# EAGLE design schematic (EAGLE 7.3.0)

## Sheet 1 of 4: Pixhawk Servo Interface
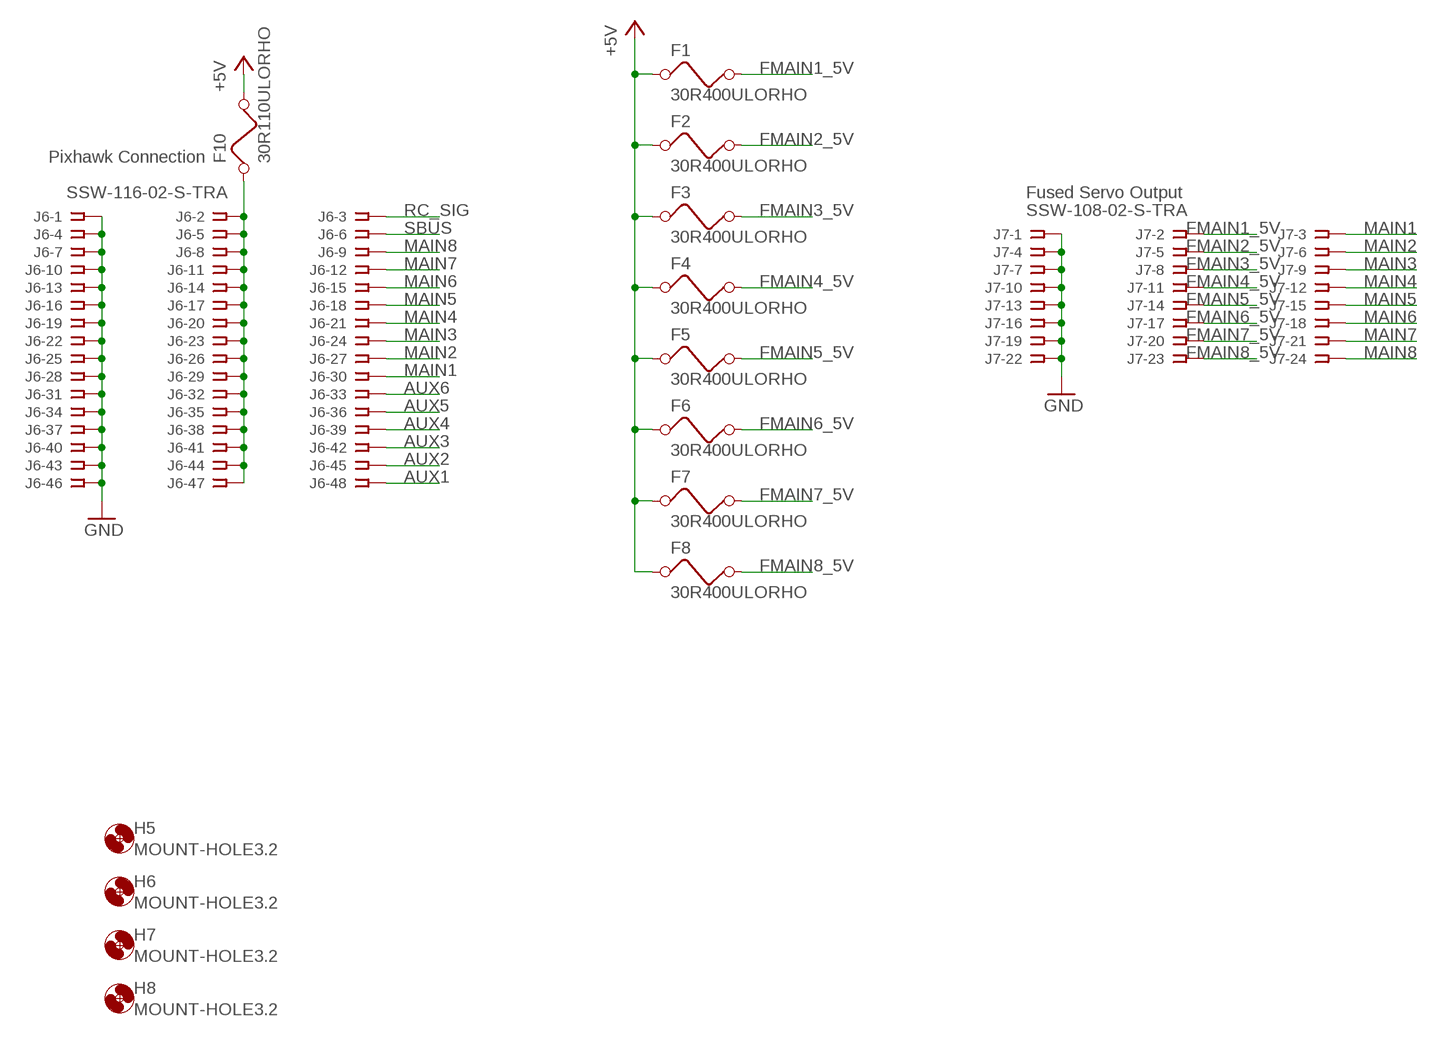
[diagram p0: schematic, sheet 1]

### Parts
F1  30R400ULORHO  [1206]
F2  30R400ULORHO  [1206]
F3  30R400ULORHO  [1206]
F4  30R400ULORHO  [1206]
F5  30R400ULORHO  [1206]
F6  30R400ULORHO  [1206]
F7  30R400ULORHO  [1206]
F8  30R400ULORHO  [1206]
F10  30R110ULORHO  [1206]
H5  MOUNT-HOLE3.2  [3,2]
H6  MOUNT-HOLE3.2  [3,2]
H7  MOUNT-HOLE3.2  [3,2]
H8  MOUNT-HOLE3.2  [3,2]
J6  SSW-116-02-S-TRA  [SSW-116-02-S-T-RA]
J7  SSW-108-02-S-TRA  [SSW-108-02-S-T-RA]

### Nets
+5V: F1.1 F2.1 F3.1 F4.1 F5.1 F6.1 F7.1 F8.1 F10.2 ; also sheet 2,3,4
AUX1: J6.48 ; also sheet 4
AUX2: J6.45 ; also sheet 4
AUX3: J6.42 ; also sheet 4
AUX4: J6.39
AUX5: J6.36 ; also sheet 4
AUX6: J6.33 ; also sheet 4
FMAIN1_5V: F1.2 J7.2
FMAIN2_5V: F2.2 J7.5
FMAIN3_5V: F3.2 J7.8
FMAIN4_5V: F4.2 J7.11
FMAIN5_5V: F5.2 J7.14
FMAIN6_5V: F6.2 J7.17
FMAIN7_5V: F7.2 J7.20
FMAIN8_5V: F8.2 J7.23
GND: J6.1 J6.4 J6.7 J6.10 J6.13 J6.16 J6.19 J6.22 J6.25 J6.28 J6.31 J6.34 J6.37 J6.40 J6.43 J6.46 J7.1 J7.4 J7.7 J7.10 J7.13 J7.16 J7.19 J7.22 ; also sheet 2,3,4
MAIN1: J6.30 J7.3
MAIN2: J6.27 J7.6
MAIN3: J6.24 J7.9
MAIN4: J6.21 J7.12
MAIN5: J6.18 J7.15
MAIN6: J6.15 J7.18
MAIN7: J6.12 J7.21
MAIN8: J6.9 J7.24
N$5: F10.1 J6.2 J6.5 J6.8 J6.11 J6.14 J6.17 J6.20 J6.23 J6.26 J6.29 J6.32 J6.35 J6.38 J6.41 J6.44 J6.47
RC_SIG: J6.3 ; also sheet 3
SBUS: J6.6

### Notes on the sheet
- Pixhawk Connection
- Fused Servo Output

## Sheet 2 of 4: Power
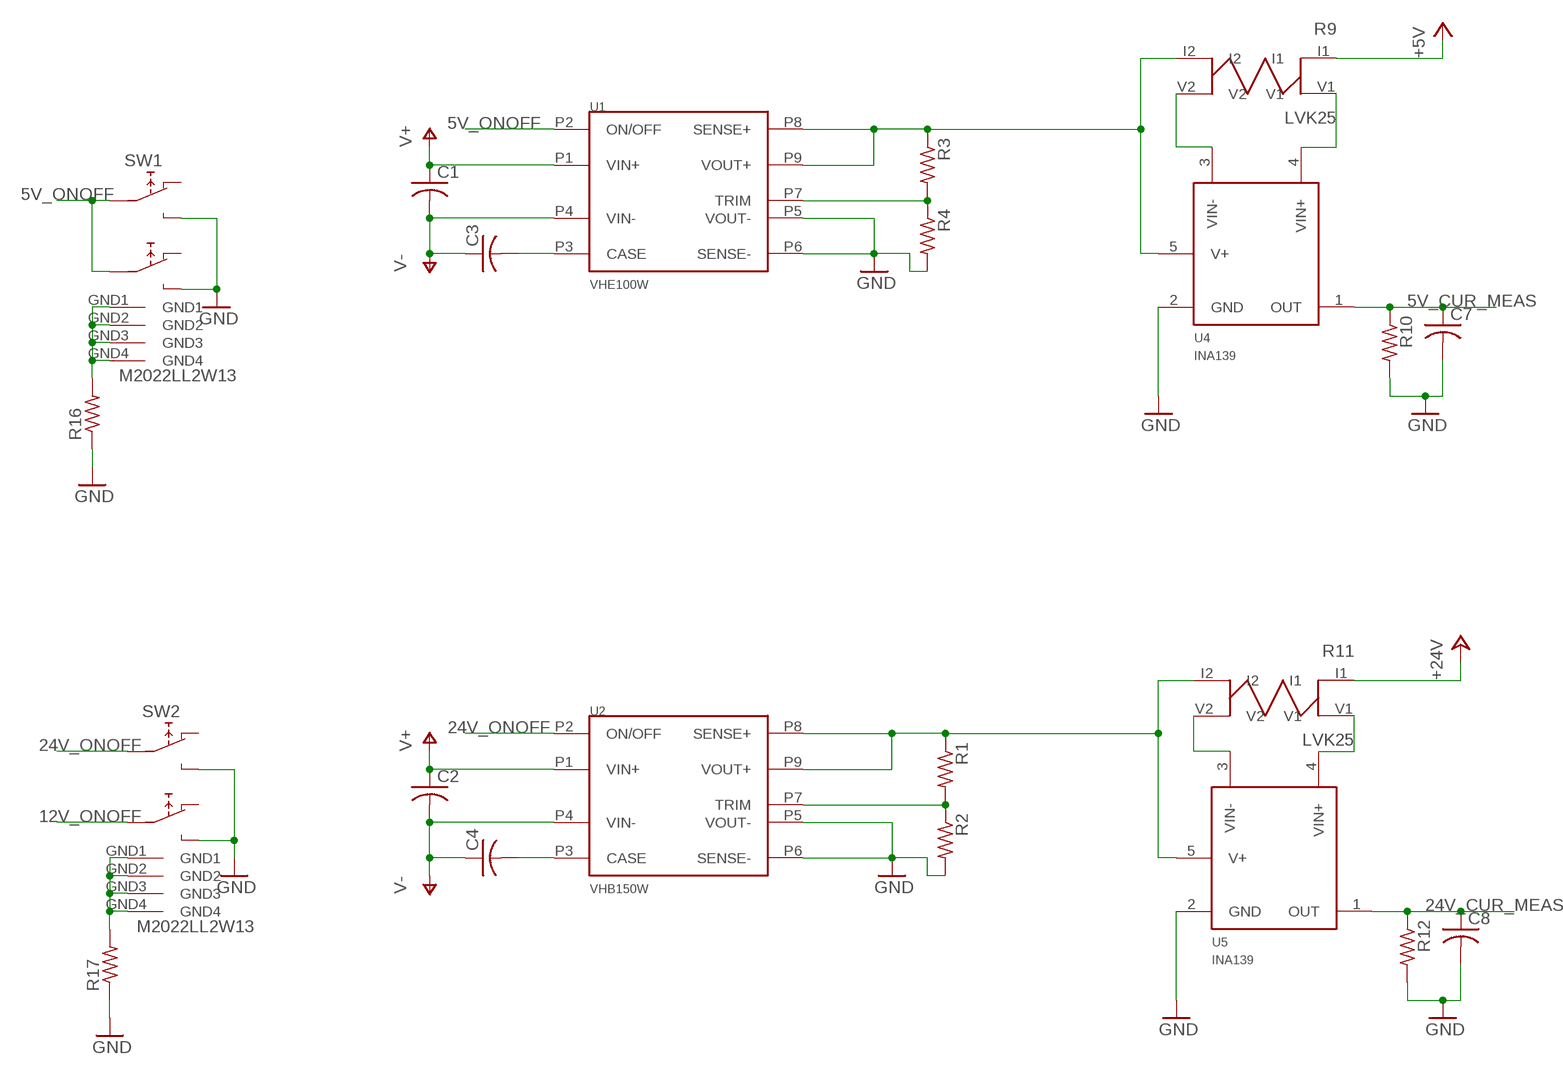
[diagram p1: schematic, sheet 2, part 1 of 2]
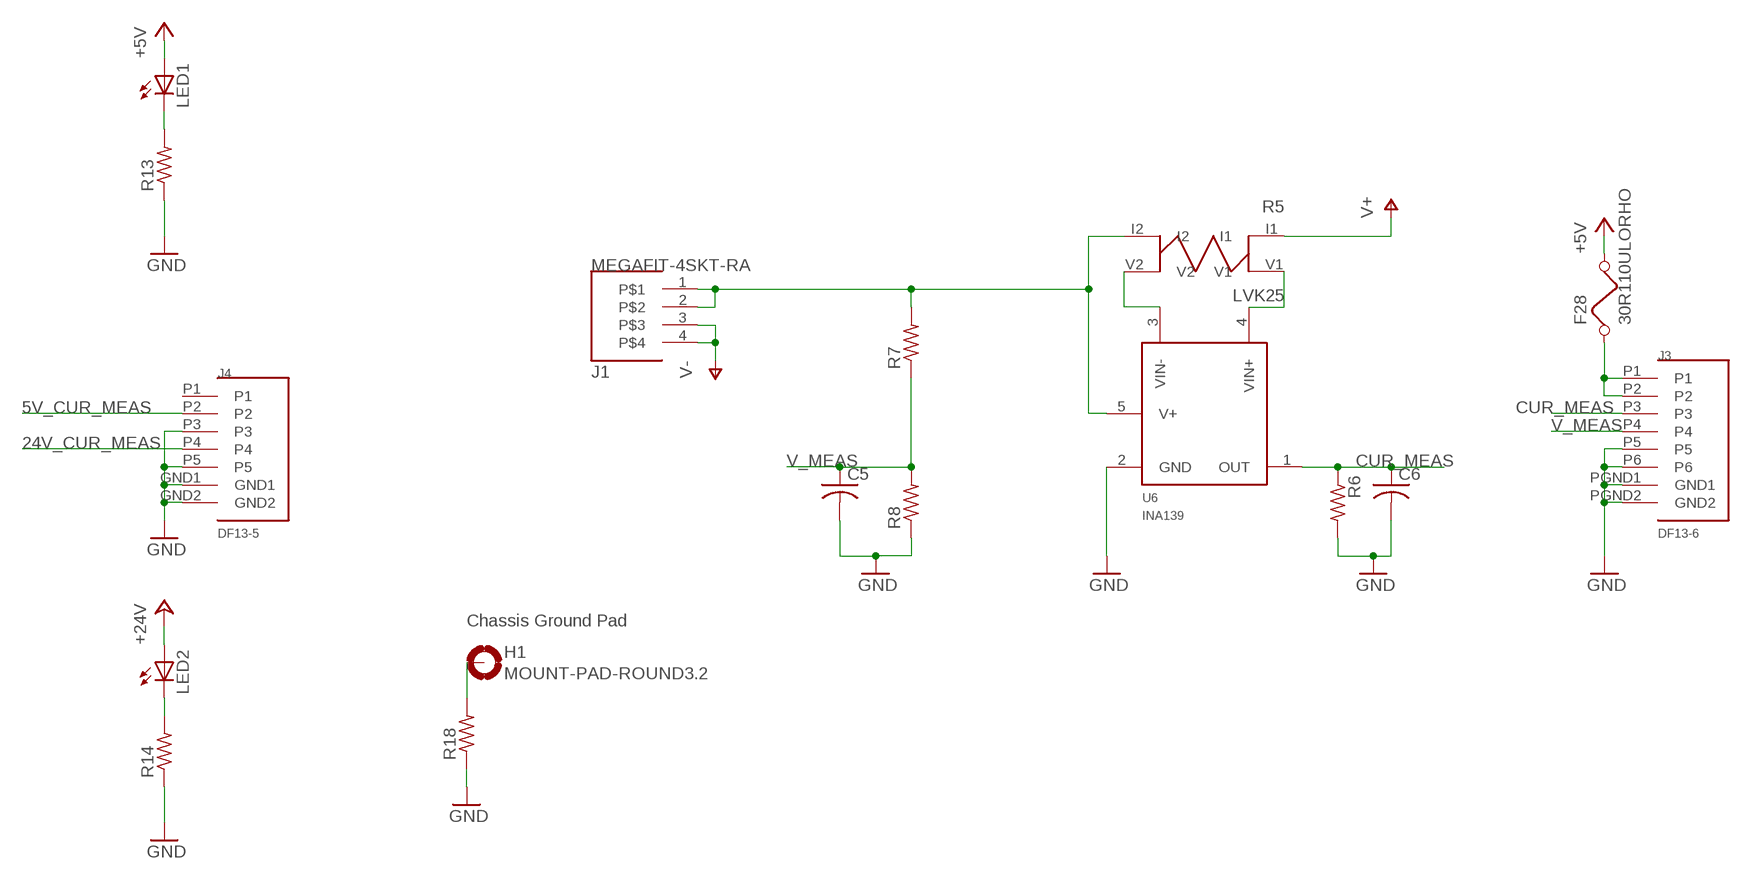
[diagram p2: schematic, sheet 2, part 2 of 2]

### Parts
C1  C-USC1210  [C1210]
C2  C-USC1210  [C1210]
C3  C-USC1210  [C1210]
C4  C-USC1210  [C1210]
C5  C-USC0805  [C0805]
C6  C-USC0805  [C0805]
C7  C-USC0805  [C0805]
C8  C-USC0805  [C0805]
F28  30R110ULORHO  [1206]
H1  MOUNT-PAD-ROUND3.2  [3,2-PAD]
J1  MEGAFIT-4SKT-RA  [MEGAFIT-4SKT-RA]
J3  DF13-6  [DF13-6]
J4  DF13-5  [DF13-5]
LED1  LEDCHIPLED_0805  [CHIPLED_0805]
LED2  LEDCHIPLED_0805  [CHIPLED_0805]
R1  R-US_M0805  [M0805]
R2  R-US_M0805  [M0805]
R3  R-US_M0805  [M0805]
R4  R-US_M0805  [M0805]
R5  LVK25  [LVK25]
R6  R-US_M0805  [M0805]
R7  R-US_M0805  [M0805]
R8  R-US_M0805  [M0805]
R9  LVK25  [LVK25]
R10  R-US_M0805  [M0805]
R11  LVK25  [LVK25]
R12  R-US_M0805  [M0805]
R13  R-US_M0805  [M0805]
R14  R-US_M0805  [M0805]
R16  R-US_M0805  [M0805]
R17  R-US_M0805  [M0805]
R18  R-US_M0805  [M0805]
SW1  M2022LL2W13  [M2022LL2W13]
SW2  M2022LL2W13  [M2022LL2W13]
U1  VHE100W  [VHE100W]
U2  VHB150W  [VHB150W]
U4  INA139  [SOT23-5]
U5  INA139  [SOT23-5]
U6  INA139  [SOT23-5]

### Nets
5V_CUR_MEAS: C7.1 J4.P2 R10.1 U4.1(OUT)
5V_ONOFF: SW1.P2(1A) SW1.P5(1A1) U1.P2(ON/OFF)
12V_ONOFF: SW2.P5(1A1)
24V_CUR_MEAS: C8.1 J4.P4 R12.1 U5.1(OUT)
24V_ONOFF: SW2.P2(1A) U2.P2(ON/OFF)
+5V: F28.2 LED1.A R9.I1 ; also sheet 1,3,4
+24V: LED2.A R11.I1 ; also sheet 4
CUR_MEAS: C6.1 J3.P3 R6.1 U6.1(OUT)
GND: C5.2 C6.2 C7.2 C8.2 J3.P5 J3.P6 J3.PGND1(GND1) J3.PGND2(GND2) J4.GND1 J4.GND2 J4.P3 J4.P5 R2.2 R4.2 R6.2 R8.1 R10.2 R12.2 R13.1 R14.1 R16.1 R17.1 R18.1 SW1.P1(NO) SW1.P4(NO1) SW2.P1(NO) SW2.P4(NO1) U1.P5(VOUT-) U1.P6(SENSE-) U2.P5(VOUT-) U2.P6(SENSE-) U4.2(GND) U5.2(GND) U6.2(GND) ; also sheet 1,3,4
N$7: R1.2 R2.1 U2.P7(TRIM)
N$8: R3.2 R4.1 U1.P7(TRIM)
N$9: C3.2 U1.P3(CASE)
N$11: C4.2 U2.P3(CASE)
N$12: R9.V2 U4.3(VIN-)
N$13: R9.V1 U4.4(VIN+)
N$15: F28.1 J3.P1 J3.P2
N$17: R11.V2 U5.3(VIN-)
N$18: LED2.C R14.2
N$19: LED1.C R13.2
N$21: R1.1 R11.I2 U2.P8(SENSE+) U2.P9(VOUT+) U5.5(V+)
N$22: R11.V1 U5.4(VIN+)
N$23: R3.1 R9.I2 U1.P8(SENSE+) U1.P9(VOUT+) U4.5(V+)
N$24: R5.V2 U6.3(VIN-)
N$25: J1.1 J1.2 R5.I2 R7.2 U6.5(V+)
N$36: R5.V1 U6.4(VIN+)
N$37: H1.B3,2(MOUNT) R18.2
N$38: R17.2 SW2.GND1 SW2.GND2 SW2.GND3 SW2.GND4
N$39: R16.2 SW1.GND1 SW1.GND2 SW1.GND3 SW1.GND4
V+: C1.1 C2.1 R5.I1 U1.P1(VIN+) U2.P1(VIN+)
V-: C1.2 C2.2 C3.1 C4.1 J1.3 J1.4 U1.P4(VIN-) U2.P4(VIN-)
V_MEAS: C5.1 J3.P4 R7.1 R8.2
Unconnected: J4.P1 SW1.P3(NC) SW1.P6(NC1) SW2.P3(NC) SW2.P6(NC1)

### Notes on the sheet
- Chassis Ground Pad

## Sheet 3 of 4: Radios
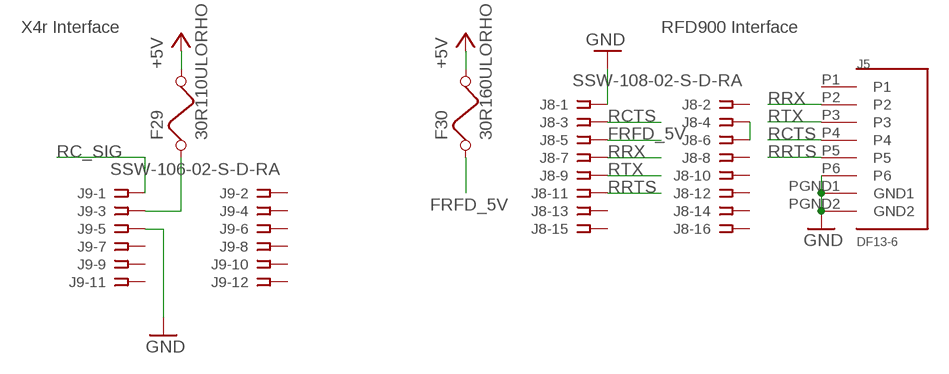
[diagram p3: schematic, sheet 3]

### Parts
F29  30R110ULORHO  [1206]
F30  30R160ULORHO  [1206]
J5  DF13-6  [DF13-6]
J8  SSW-108-02-S-D-RA  [TSW-108-02-S-D-RA]
J9  SSW-106-02-S-D-RA  [TSW-106-02-S-D-RA]

### Nets
+5V: F29.2 F30.2 ; also sheet 1,2,4
FRFD_5V: F30.1 J8.5
GND: J5.P6 J5.PGND1(GND1) J5.PGND2(GND2) J8.1 J9.5 ; also sheet 1,2,4
N$3: F29.1 J9.3
N$6: J8.4 J8.6
RC_SIG: J9.1 ; also sheet 1
RCTS: J5.P4 J8.3
RRTS: J5.P5 J8.11
RRX: J5.P2 J8.7
RTX: J5.P3 J8.9
Unconnected: J5.P1 J8.2 J8.8 J8.10 J8.12 J8.13 J8.14 J8.15 J8.16 J9.2 J9.4 J9.6 J9.7 J9.8 J9.9 J9.10 J9.11 J9.12

### Notes on the sheet
- X4r Interface | RFD900 Interface

## Sheet 4 of 4: Payload
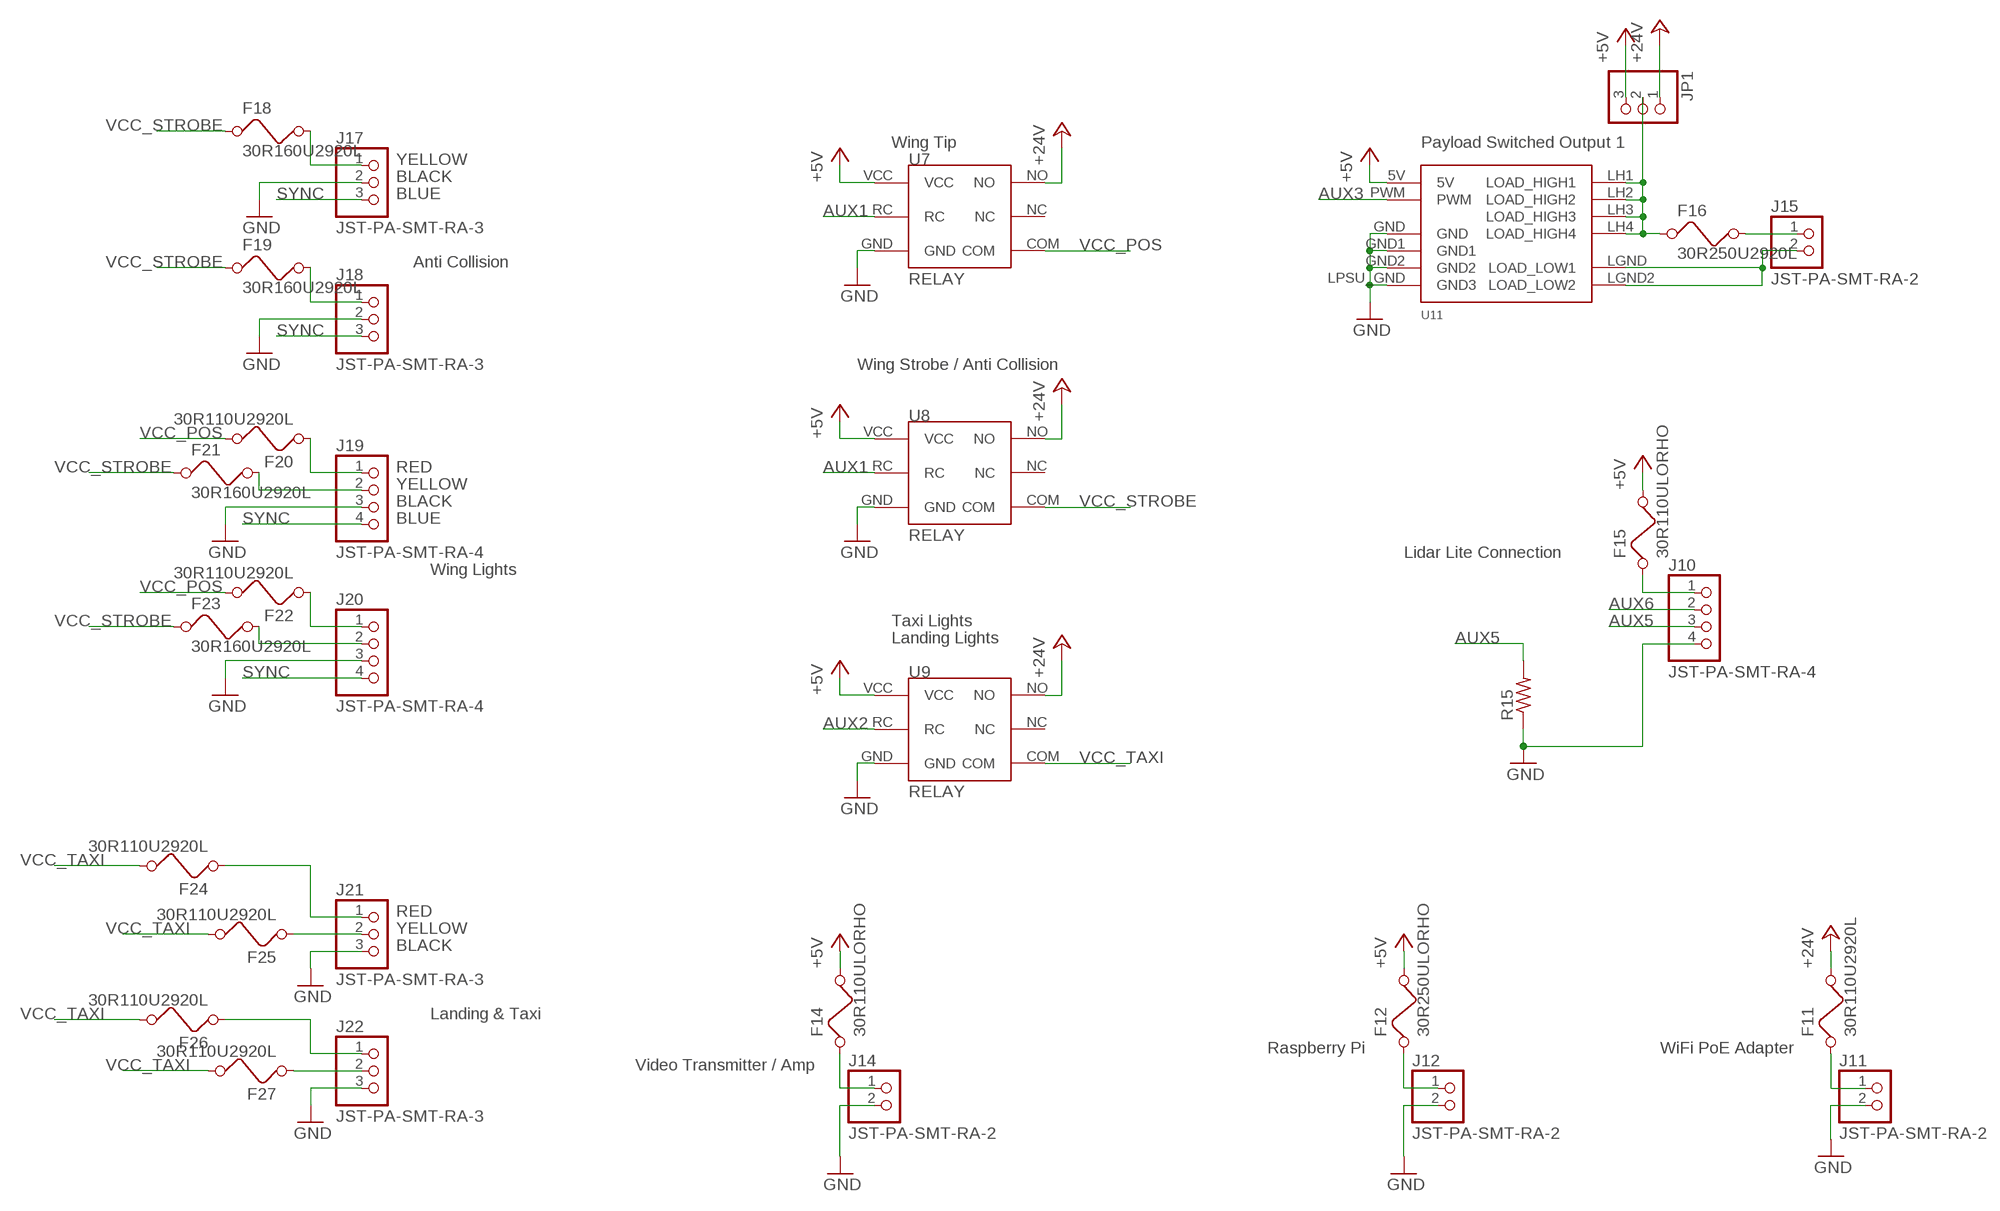
[diagram p4: schematic, sheet 4]

### Parts
F11  30R110U2920L  [2920L]
F12  30R250ULORHO  [1206]
F14  30R110ULORHO  [1206]
F15  30R110ULORHO  [1206]
F16  30R250U2920L  [2920L]
F18  30R160U2920L  [2920L]
F19  30R160U2920L  [2920L]
F20  30R110U2920L  [2920L]
F21  30R160U2920L  [2920L]
F22  30R110U2920L  [2920L]
F23  30R160U2920L  [2920L]
F24  30R110U2920L  [2920L]
F25  30R110U2920L  [2920L]
F26  30R110U2920L  [2920L]
F27  30R110U2920L  [2920L]
J10  JST-PA-SMT-RA-4  [JST-PA-SMT-RA-4]
J11  JST-PA-SMT-RA-2  [JST-PA-SMT-RA-2]
J12  JST-PA-SMT-RA-2  [JST-PA-SMT-RA-2]
J14  JST-PA-SMT-RA-2  [JST-PA-SMT-RA-2]
J15  JST-PA-SMT-RA-2  [JST-PA-SMT-RA-2]
J17  JST-PA-SMT-RA-3  [JST-PA-SMT-RA-3]
J18  JST-PA-SMT-RA-3  [JST-PA-SMT-RA-3]
J19  JST-PA-SMT-RA-4  [JST-PA-SMT-RA-4]
J20  JST-PA-SMT-RA-4  [JST-PA-SMT-RA-4]
J21  JST-PA-SMT-RA-3  [JST-PA-SMT-RA-3]
J22  JST-PA-SMT-RA-3  [JST-PA-SMT-RA-3]
JP1  PINHD-1X3  [1X03]
R15  R-US_M0805  [M0805]
U7  RELAY  [RELAY]
U8  RELAY  [RELAY]
U9  RELAY  [RELAY]
U11  MED_MOSFET  [MED_MOSFET]

### Nets
+5V: F12.2 F14.2 F15.2 JP1.3 U7.VCC U8.VCC U9.VCC U11.5V ; also sheet 1,2,3
+24V: F11.P$2 JP1.1 U7.NO U8.NO U9.NO ; also sheet 2
AUX1: U7.RC U8.RC ; also sheet 1
AUX2: U9.RC ; also sheet 1
AUX3: U11.PWM ; also sheet 1
AUX5: J10.3 R15.2 ; also sheet 1
AUX6: J10.2 ; also sheet 1
GND: J10.4 J11.2 J12.2 J14.2 J17.2 J18.2 J19.3 J20.3 J21.3 J22.3 R15.1 U7.GND U8.GND U9.GND U11.GND U11.GND1 U11.GND2 U11.LPSU_GND(GND3) ; also sheet 1,2,3
N$1: F12.1 J12.1
N$2: F15.1 J10.1
N$4: F16.P$1 JP1.2 U11.LH1(LOAD_HIGH1) U11.LH2(LOAD_HIGH2) U11.LH3(LOAD_HIGH3) U11.LH4(LOAD_HIGH4)
N$10: F11.P$1 J11.1
N$14: F16.P$2 J15.1
N$16: J15.2 U11.LGND2(LOAD_LOW2) U11.LGND(LOAD_LOW1)
N$20: F14.1 J14.1
N$26: F20.P$1 J19.1
N$27: F21.P$2 J19.2
N$28: F22.P$1 J20.1
N$29: F23.P$2 J20.2
N$30: F18.P$2 J17.1
N$31: F19.P$2 J18.1
N$32: F27.P$1 J22.2
N$33: F26.P$1 J22.1
N$34: F25.P$1 J21.2
N$35: F24.P$1 J21.1
SYNC: J17.3 J18.3 J19.4 J20.4
VCC_POS: F20.P$2 F22.P$2 U7.COM
VCC_STROBE: F18.P$1 F19.P$1 F21.P$1 F23.P$1 U8.COM
VCC_TAXI: F24.P$2 F25.P$2 F26.P$2 F27.P$2 U9.COM
Unconnected: U7.NC U8.NC U9.NC

### Notes on the sheet
- Wing Tip | Payload Switched Output 1
- YELLOW
- BLACK
- BLUE
- Anti Collision
- Wing Strobe / Anti Collision
- RED
- YELLOW
- BLACK
- BLUE
- Lidar Lite Connection
- Wing Lights
- Taxi Lights
- Landing Lights
- RED
- YELLOW
- BLACK
- Landing & Taxi
- Raspberry Pi | WiFi PoE Adapter
- Video Transmitter / Amp

## Library data of the parts
C1-C8 = rcl:C-US: CAPACITOR, American symbol
F1-F8 = littelfuse:30R400U
F10 F11 F14 F15 F20 F22 F24-F29 = littelfuse:30R110U
F12 F16 = littelfuse:30R250U
F18 F19 F21 F23 F30 = littelfuse:30R160U
H1 = holes:MOUNT-PAD-ROUND: MOUNTING PAD, round
H5-H8 = holes:MOUNT-HOLE: MOUNTING HOLE with drill center marker
J1 = molex:MEGAFIT-4SKT-RA
J3 J5 = df13:DF13-6
J4 = df13:DF13-5
J6 = con-samtec:SSW-116-02-S-T: THROUGH-HOLE .025" SQ POST SOCKET Source: Samtec SSW.pdf; MPN: SSW-116-02-S-T-RA; OC_FARNELL: unknown; OC_NEWARK: 82P7262
J7 = con-samtec:SSW-108-02-S-T: THROUGH-HOLE .025" SQ POST SOCKET Source: Samtec SSW.pdf; MPN: SSW-108-02-S-T-RA; OC_FARNELL: unknown; OC_NEWARK: 82P4352
J8 = con-samtec:SSW-108-02-S-D: THROUGH-HOLE .025" SQ POST SOCKET Source: Samtec SSW.pdf; MPN: SSW-108-02-S-D-RA; OC_FARNELL: unknown; OC_NEWARK: 11P9447
J9 = con-samtec:SSW-106-02-S-D: THROUGH-HOLE .025" SQ POST SOCKET Source: Samtec SSW.pdf; MPN: SSW-106-02-S-D-RA; OC_FARNELL: unknown; OC_NEWARK: 11P9415
J10 J19 J20 = jst:JST-PA-SMT-RA-4
J11 J12 J14 J15 = jst:JST-PA-SMT-RA-2
J17 J18 J21 J22 = jst:JST-PA-SMT-RA-3
JP1 = pinhead:PINHD-1X3: PIN HEADER
LED1 LED2 = led:LED: LED OSRAM: - CHIPLED LG R971, LG N971, LY N971, LG Q971, LY Q971, LO R971, LY R971 LH N974, LH R974 LS Q976, LO Q976, LY Q976 LO Q996 - Hyper CHIPLED LW Q18S LB Q993, LB Q99A, LB R99A - SideLED LS A670, LO A670, LY A670, LG A670, LP A670 LB A673, LV A673, LT A673, LW A673 LH A674 LY A675 LS A676, LA A676, LO A676, LY A676, LW A676 LS A679, LY A679, LG A679 - Hyper Micro SIDELED® LS Y876, LA Y876, LO Y876, LY Y876 LT Y87S - SmartLED LW L88C, LW L88S LB L89C, LB L89S, LG L890 LS L89K, LO L89K, LY L89K LS L896, LA L896, LO L896, LY L896 - TOPLED LS T670, LO T670, LY T670, LG T670, LP T670 LSG T670, LSP T670, LSY T670, LOP T670, LYG T670 LG T671, LOG T671, LSG T671 LB T673, LV T673, LT T673, LW T673 LH T674 LS T676, LA T676, LO T676, LY T676, LB T676, LH T676, LSB T676, LW T676 LB T67C, LV T67C, LT T67C, LS T67K, LO T67K, LY T67K, LW E67C LS E67B, LA E67B, LO E67B, LY E67B, LB E67C, LV E67C, LT E67C LW T67C LS T679, LY T679, LG T679 LS T770, LO T770, LY T770, LG T770, LP T770 LB T773, LV T773, LT T773, LW T773 LH T774 LS E675, LA E675, LY E675, LS T675 LS T776, LA T776, LO T776, LY T776, LB T776 LHGB T686 LT T68C, LB T68C - Hyper Mini TOPLED® LB M676 - Mini TOPLED Santana® LG M470 LS M47K, LO M47K, LY M47K Source: http://www.osram.convergy.de LUXEON: - LUMILED® LXK2-PW12-R00, LXK2-PW12-S00, LXK2-PW14-U00, LXK2-PW14-V00 LXK2-PM12-R00, LXK2-PM12-S00, LXK2-PM14-U00 LXK2-PE12-Q00, LXK2-PE12-R00, LXK2-PE12-S00, LXK2-PE14-T00, LXK2-PE14-U00 LXK2-PB12-K00, LXK2-PB12-L00, LXK2-PB12-M00, LXK2-PB14-N00, LXK2-PB14-P00, LXK2-PB14-Q00 LXK2-PR12-L00, LXK2-PR12-M00, LXK2-PR14-Q00, LXK2-PR14-R00 LXK2-PD12-Q00, LXK2-PD12-R00, LXK2-PD12-S00 LXK2-PH12-R00, LXK2-PH12-S00 LXK2-PL12-P00, LXK2-PL12-Q00, LXK2-PL12-R00 Source: www.luxeon.com KINGBRIGHT: KA-3528ASYC Source: www.kingbright.com
R1-R4 R6-R8 R10 R12-R18 = rcl:R-US_: RESISTOR, American symbol
R5 R9 R11 = lvk_resistor:LVK25
SW1 SW2 = switch:M2022LL2W13
U1 = cui:VHE100W
U2 = cui:VHB150W
U4-U6 = ti:INA139
U7-U9 = pololu:RELAY
U11 = pololu:MED_MOSFET

## Board
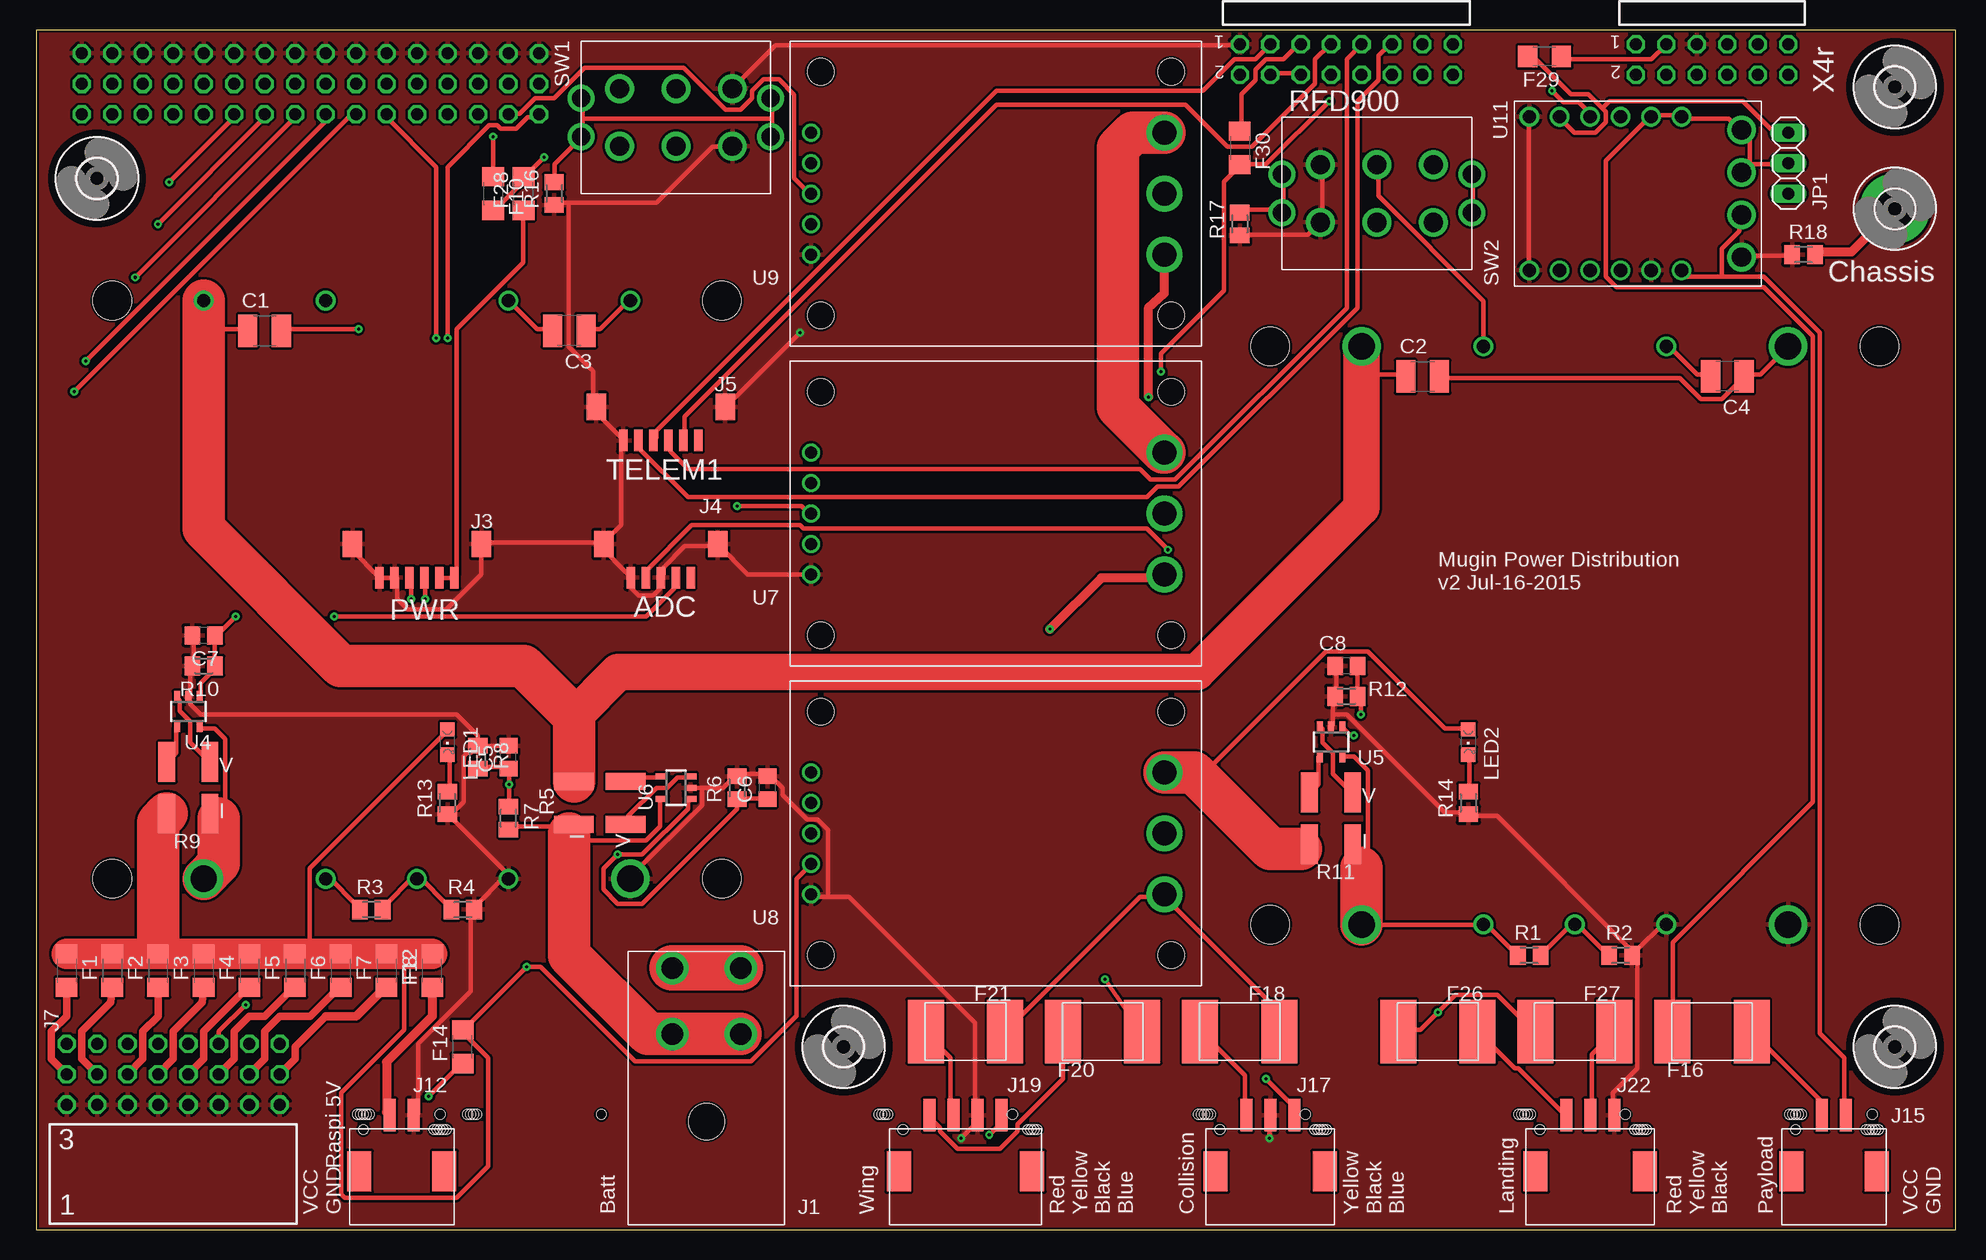
[diagram p5: board, top side]
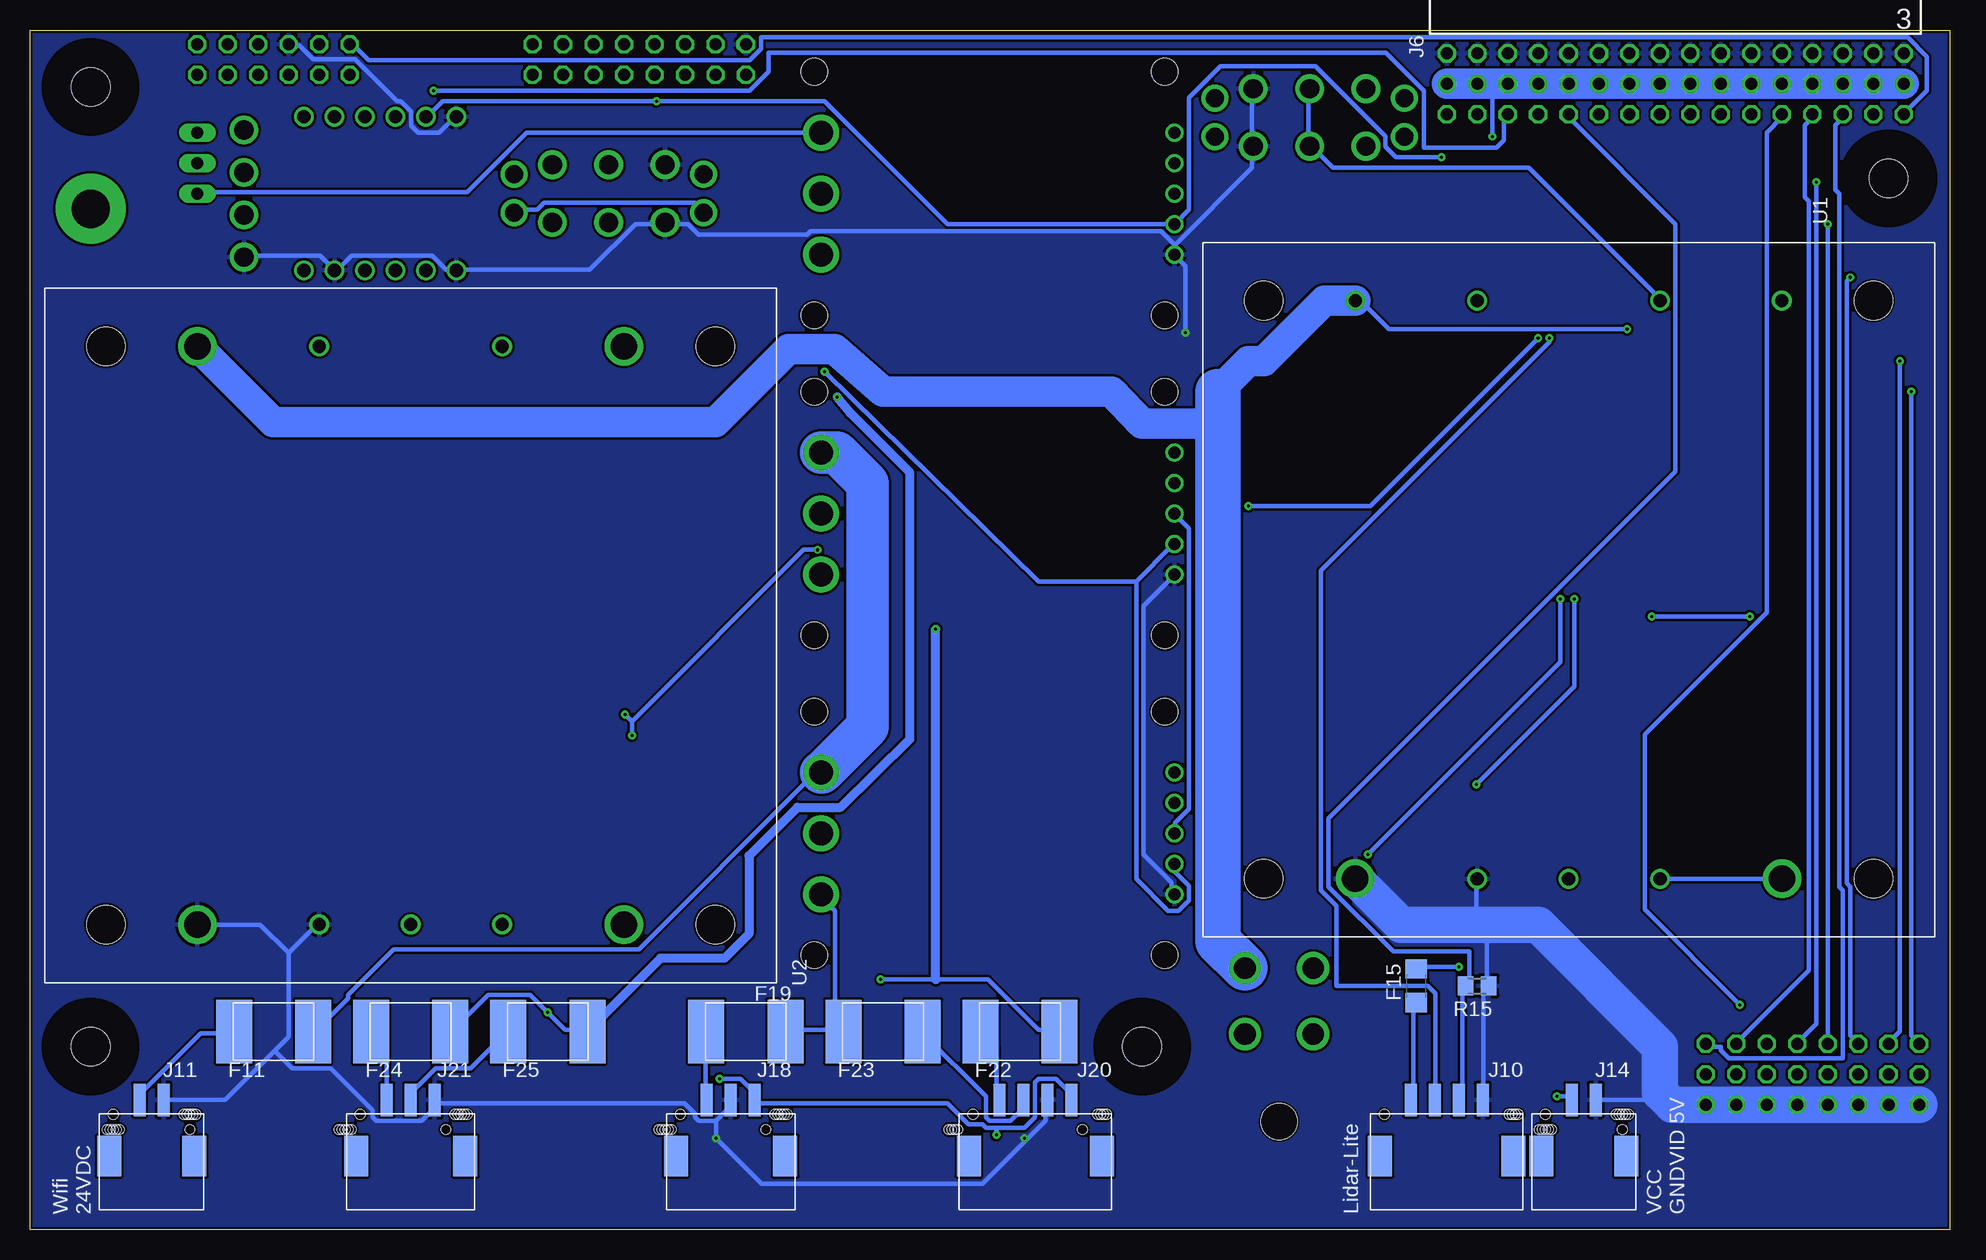
[diagram p6: board, bottom side, seen from below]

Size 160 x 100 mm. Coordinates in mm from the lower left corner, seen from the top.
Outline: 0,0 160,0 160,100 0,100 0,0
Copper layers (1*16): Top 0.035mm / dielectric 1.5mm / Bottom 0.035mm
Design rules "default *": minimum track width 15mil, minimum drill 10mil, track to track 8mil, track to pad 8mil, pad to pad 8mil, via to via 8mil, smd to smd 8mil, copper to edge 8mil, drill to drill 8mil, minimum pad ring 10mil, minimum via ring 8mil, stop-mask expansion 4mil, vias tented up to drill 0mil, thermal gap 10mil

### Footprints (pad centres in the part's own frame; a part is rotated, then mirrored left to right if it is on the bottom)
C1210 = smd 1.6 x 2.7: 1 -1.4,0; 2 1.4,0
C0805 = smd 1.3 x 1.5: 1 -0.95,0; 2 0.95,0
1206 = smd 1.6 x 1.8: 1 -1.4,0; 2 1.4,0
2920L = smd 3 x 5.3: P$1 -3.3,0; P$2 3.3,0
3,2-PAD = drill 3.2 pad 5.842: B3,2 0,0
3,2 = hole 3.2: 0,0
MEGAFIT-4SKT-RA = drill 1.8: 1 2.85,-2.75; 2 -2.85,-2.75; 3 2.85,2.75; 4 -2.85,2.75 | hole 3: 0,-10.05
DF13-6 = smd 0.7 x 1.8: P1 -3.125,2.8; P2 -1.875,2.8; P3 -0.625,2.8; P4 0.625,2.8; P5 1.875,2.8; P6 3.125,2.8 | smd 1.6 x 2.2: PGND1 -5.375,0; PGND2 5.375,0
DF13-5 = smd 1.6 x 2.2: GND1 -4.75,0; GND2 4.75,0 | smd 0.7 x 1.8: P1 -2.5,2.8; P2 -1.25,2.8; P3 0,2.8; P4 1.25,2.8; P5 2.5,2.8
SSW-116-02-S-T-RA = drill 1 pad 1.5 octagon: 1 -19.05,1.524; 2 -19.05,4.064; 3 -19.05,6.604; 4 -16.51,1.524; 5 -16.51,4.064; 6 -16.51,6.604; 7 -13.97,1.524; 8 -13.97,4.064; 9 -13.97,6.604; 10 -11.43,1.524; 11 -11.43,4.064; 12 -11.43,6.604; 13 -8.89,1.524; 14 -8.89,4.064; 15 -8.89,6.604; 16 -6.35,1.524; 17 -6.35,4.064; 18 -6.35,6.604; 19 -3.81,1.524; 20 -3.81,4.064; 21 -3.81,6.604; 22 -1.27,1.524; 23 -1.27,4.064; 24 -1.27,6.604; 25 1.27,1.524; 26 1.27,4.064; 27 1.27,6.604; 28 3.81,1.524; 29 3.81,4.064; 30 3.81,6.604; 31 6.35,1.524; 32 6.35,4.064; 33 6.35,6.604; 34 8.89,1.524; 35 8.89,4.064; 36 8.89,6.604; 37 11.43,1.524; 38 11.43,4.064; 39 11.43,6.604; 40 13.97,1.524; 41 13.97,4.064; 42 13.97,6.604; 43 16.51,1.524; 44 16.51,4.064; 45 16.51,6.604; 46 19.05,1.524; 47 19.05,4.064; 48 19.05,6.604
SSW-108-02-S-T-RA = drill 1 pad 1.5 octagon: 1 -8.89,1.524; 2 -8.89,4.064; 3 -8.89,6.604; 4 -6.35,1.524; 5 -6.35,4.064; 6 -6.35,6.604; 7 -3.81,1.524; 8 -3.81,4.064; 9 -3.81,6.604; 10 -1.27,1.524; 11 -1.27,4.064; 12 -1.27,6.604; 13 1.27,1.524; 14 1.27,4.064; 15 1.27,6.604; 16 3.81,1.524; 17 3.81,4.064; 18 3.81,6.604; 19 6.35,1.524; 20 6.35,4.064; 21 6.35,6.604; 22 8.89,1.524; 23 8.89,4.064; 24 8.89,6.604
TSW-108-02-S-D-RA = drill 1 pad 1.5 octagon: 1 8.89,1.524; 2 8.89,4.064; 3 6.35,1.524; 4 6.35,4.064; 5 3.81,1.524; 6 3.81,4.064; 7 1.27,1.524; 8 1.27,4.064; 9 -1.27,1.524; 10 -1.27,4.064; 11 -3.81,1.524; 12 -3.81,4.064; 13 -6.35,1.524; 14 -6.35,4.064; 15 -8.89,1.524; 16 -8.89,4.064
TSW-106-02-S-D-RA = drill 1 pad 1.5 octagon: 1 6.35,1.524; 2 6.35,4.064; 3 3.81,1.524; 4 3.81,4.064; 5 1.27,1.524; 6 1.27,4.064; 7 -1.27,1.524; 8 -1.27,4.064; 9 -3.81,1.524; 10 -3.81,4.064; 11 -6.35,1.524; 12 -6.35,4.064
JST-PA-SMT-RA-4 = smd 1 x 2.7: 1 3,-4.45; 2 1,-4.45; 3 -1,-4.45; 4 -3,-4.45 | smd 2 x 3.343: P$5 -5.55,0.229; P$6 5.55,0.229 | hole 0.8: 5.2,-3.25; -5.7,-3.25; -5.45,-3.25; -5.2,-3.25; -5.95,-3.25; -5.7,-3.25
JST-PA-SMT-RA-2 = smd 1 x 2.7: 1 1,-4.45; 2 -1,-4.45 | smd 2 x 3.343: GND1 3.55,0.229; GND2 -3.55,0.229 | hole 0.8: 3.2,-3.25; -2.7,-3.25; -3.7,-3.25; -2.95,-3.25; -3.2,-3.25; -3.45,-3.25
JST-PA-SMT-RA-3 = smd 1 x 2.7: 1 2,-4.45; 2 0,-4.45; 3 -2,-4.45 | smd 2 x 3.343: P$4 -4.55,0.229; P$5 4.55,0.229 | hole 0.8: 4.2,-3.25; -4.7,-3.25; -4.45,-3.25; -4.2,-3.25; -3.95,-3.25; -3.7,-3.25
1X03 = drill 1.016 long: 1 -2.54,0; 2 0,0; 3 2.54,0
CHIPLED_0805 = smd 1.2 x 1.2: A 0,-1.05; C 0,1.05
M0805 = smd 1.3 x 1.6: 1 -0.95,0; 2 0.95,0
LVK25 = smd 1.4 x 3.3: I1 -1.8,-2.15; I2 1.8,-2.15; V1 -1.8,2.15; V2 1.8,2.15
M2022LL2W13 = drill 1.5: GND1 -1.6,-7.9; GND2 1.6,-7.9; GND3 -1.6,7.9; GND4 1.6,7.9 | drill 1.6: P1 -2.4,-4.7; P2 -2.4,0; P3 -2.4,4.7; P4 2.4,-4.7; P5 2.4,0; P6 2.4,4.7
VHE100W = drill 1.1: P1 24.1,-17.78; P2 24.1,-7.62; P3 24.1,7.62; P4 24.1,17.78; P6 -24.1,7.62; P7 -24.1,0; P8 -24.1,-7.62 | drill 2.2: P5 -24.1,17.78; P9 -24.1,-17.78 | hole 3.2: 24.1,25.4; -24.1,25.4; -24.1,-25.4; 24.1,-25.4
VHB150W = drill 2.2: P1 24.1,-17.78; P4 24.1,17.78; P5 -24.1,17.78; P9 -24.1,-17.78 | drill 1.1: P2 24.1,-7.62; P3 24.1,7.62; P6 -24.1,7.62; P7 -24.1,0; P8 -24.1,-7.62 | hole 3.2: 24.1,25.4; -24.1,25.4; -24.1,-25.4; 24.1,-25.4
SOT23-5 = smd 0.5 x 1: 1 -0.95,-1.2; 2 0,-1.2; 3 0.95,-1.2; 4 0.95,1.2; 5 -0.95,1.2
RELAY = drill 2: COM 14.046,-5.08; NC 14.046,0; NO 14.046,5.08 | drill 1: GND -15.418,-5.08; GOOD -15.418,5.08; OUT -15.418,2.54; RC -15.418,0; VCC -15.418,-2.54 | hole 2.2: 14.605,-10.16; 14.605,10.16; -14.605,10.16; -14.605,-10.16; 14.605,-10.16
MED_MOSFET = drill 1.1: 5V -6.4,-3.81; GND -6.4,-6.35; GND1 6.4,-6.35; GND2 6.4,3.81; LGND2 6.4,6.35; LH1 -6.4,3.81; LH2 -6.4,6.35; P$1 -6.4,1.27; P$7 6.4,1.27; P$10 6.4,-1.27; P$11 6.4,-3.81; PWM -6.4,-1.27 | drill 1.6: LGND 1.77,11.35; LH3 -5.3,11.35; LH4 -1.77,11.35; LPSU_GND 5.3,11.35

### Placement (x,y rotation side)
C1  19.05,74.93 0 top
C2  115.57,71.12 0 top
C3  44.45,74.93 180 top
C4  140.97,71.12 180 top
C5  39.37,39.37 90 top
C6  60.96,36.83 90 top
C7  13.97,49.53 180 top
C8  109.22,46.99 180 top
F1  2.54,21.59 270 top
F2  6.35,21.59 270 top
F3  10.16,21.59 270 top
F4  13.97,21.59 270 top
F5  17.78,21.59 270 top
F6  21.59,21.59 270 top
F7  25.4,21.59 270 top
F8  29.21,21.59 270 top
F10  38.1,86.36 270 top
F11  139.7,16.51 0 bottom
F12  33.02,21.59 90 top
F14  35.56,15.24 90 top
F15  44.45,20.32 90 bottom
F16  139.7,16.51 0 top
F18  100.33,16.51 180 top
F19  100.33,16.51 180 bottom
F20  88.9,16.51 0 top
F21  77.47,16.51 180 top
F22  77.47,16.51 0 bottom
F23  88.9,16.51 0 bottom
F24  128.27,16.51 0 bottom
F25  116.84,16.51 0 bottom
F26  116.84,16.51 180 top
F27  128.27,16.51 180 top
F28  40.64,86.36 90 top
F29  125.73,97.79 180 top
F30  100.33,90.17 270 top
H1  154.94,85.09 0 top
H5  5.08,87.63 0 top
H6  67.31,15.24 0 top
H7  154.94,15.24 0 top
H8  154.94,95.25 0 top
J1  55.88,19.05 0 top
J3  31.75,57.15 180 top
J4  52.07,57.15 180 top
J5  52.07,68.58 180 top
J6  22.86,99.57 180 bottom
J7  11.43,8.89 0 top
J8  109.22,100.33 180 top
J9  139.7,100.33 180 top
J10  41.91,6.35 180 bottom
J11  149.86,6.35 180 bottom
J12  30.48,5.08 180 top
J14  30.48,6.35 180 bottom
J15  149.86,5.08 180 top
J17  102.87,5.08 180 top
J18  101.6,6.35 180 bottom
J19  77.47,5.08 180 top
J20  76.2,6.35 180 bottom
J21  128.27,6.35 180 bottom
J22  129.54,5.08 180 top
JP1  146.05,88.9 90 top
LED1  34.29,40.64 180 top
LED2  119.38,40.64 180 top
R1  124.46,22.86 0 top
R2  132.08,22.86 0 top
R3  27.94,26.67 0 top
R4  35.56,26.67 0 top
R5  46.99,35.56 270 top
R6  58.42,36.83 90 top
R7  39.37,34.29 270 top
R8  36.83,39.37 270 top
R9  12.7,36.83 0 top
R10  13.97,46.99 180 top
R11  107.95,34.29 0 top
R12  109.22,44.45 180 top
R13  34.29,35.56 90 top
R14  119.38,35.56 90 top
R15  39.37,20.32 180 bottom
R16  43.18,86.36 90 top
R17  100.33,83.82 90 top
R18  147.32,81.28 0 top
SW1  53.34,92.71 90 top
SW2  111.76,86.36 270 top
U1  31.75,53.34 90 bottom
U2  128.27,49.53 90 bottom
U4  12.7,43.18 180 top
U5  107.95,40.64 180 top
U6  53.34,36.83 90 top
U7  80.01,59.69 0 top
U8  80.01,33.02 0 top
U9  80.01,86.36 0 top
U11  130.81,86.36 270 top

### Tracks (layer width: path | path; a pad name or v marks a point on that pad's centre or on a via)
5V_CUR_MEAS  (via drill 0.25)
  Top 0.381: U4.1 13.73,44.4 13.73,45.57 14.9,46.74 R10.1 14.9,47.03 14.9,49.37 C7.1 15.19,49.66 v16.65,51.12 | v24.83,51.12 50.83,51.12 53.16,53.45 53.16,54.33 J4.P2
  Bottom 0.381: v16.65,51.12 v24.83,51.12
5V_ONOFF
  Bottom 0.381: U1.P2 24.24,77.7 35.05,88.51 51.41,88.51 53.16,90.26 SW1.P2 53.45,90.55 53.45,94.93 SW1.P5
24V_CUR_MEAS  (via drill 0.25)
  Top 0.381: v109.83,41.19 109.54,41.19 108.95,41.77 U5.1 | v110.41,42.94 110.41,44.4 R12.1 110.12,44.69 110.12,46.74 C8.1 | v94.35,56.67 92.6,58.42 63.97,58.42 63.68,58.71 54.62,58.71 50.83,54.91 50.83,54.62 J4.P4
  Bottom 0.381: 109.83,42.35 v109.83,41.19 | v110.41,42.94 109.83,42.35 | v94.35,56.67 95.52,56.67 109.83,42.35
24V_ONOFF
  Top 0.381: U2.P2 120.64,73.9 120.64,77.41 111.87,86.17 111.87,88.51 SW2.P2
+5V  (via drill 0.25)
  Top 0.381: 22.78,22.99 22.78,30.09 34.18,41.48 LED1.A | 10.16,24.24 10.22,24.24 F3.1 | U8.VCC 64.55,30.38 63.39,29.21 63.39,17.82 59.59,14.02 49.95,14.02 42.06,21.91 v40.89,21.91 35.64,16.65 F14.2 35.64,16.36 37.68,14.31 37.68,5.26 35.05,2.63 25.7,2.63 25.41,2.92 25.41,11.39 30.67,16.65 30.67,22.99 | F10.2 38.27,85 40.89,87.63 F28.2 40.89,87.92 v42.35,89.38 | v107.78,94.06 102.53,88.8 100.48,88.8 F30.2 100.19,88.51 99.02,87.34 99.02,78.28 93.76,73.03 v93.76,71.52 | 130.57,93.47 130.86,93.18 130.86,92.3 129.98,91.43 128.23,91.43 127.06,92.6 U11.5V | 130.57,93.47 129.4,94.64 127.94,94.64 125.02,97.56 124.44,97.56 F29.2 | 130.57,93.47 131.15,94.06 142.25,94.06 144.59,91.72 146.05,91.72 JP1.3
  Top 2.54: F1.1 F2.1 F3.1 F4.1 F5.1 F6.1 22.78,22.99 F7.1 F8.1 30.67,22.99 F12.2
  Top 3.556: R9.I1 10.16,33.94 10.16,24.24 10.16,24.13
  Bottom 0.381: v40.89,21.91 44.4,21.91 F15.2 | 67.77,54.04 67.77,29.21 65.14,26.58 64.26,26.58 63.39,27.46 63.39,28.63 64.55,29.79 64.55,30.38 U8.VCC | 67.77,54.04 64.85,56.96 U7.VCC | U11.5V 126.77,92.89 125.6,94.06 v107.78,94.06 93.76,94.06 83.54,83.83 64.85,83.83 U9.VCC 64.55,83.83 63.39,85 63.39,94.35 60.76,96.98 52.87,96.98 47.03,91.14 47.03,90.26 46.15,89.38 v42.35,89.38 | 67.77,54.04 75.95,54.04 v93.76,71.52
+24V
  Top 0.381: 96.96,37.66 107.49,48.2 111,48.2 117.42,41.77 119.18,41.77 LED2.A | R11.I1 106.32,32.13 105.41,31.75
  Top 3.556: U8.NO 96.52,38.1 96.96,37.66 102.87,31.75 105.41,31.75 | U7.NO 93.98,64.77 90.17,68.58 90.17,90.17 91.44,91.44 U9.NO
  Bottom 0.381: JP1.1 146.05,86.46 123.56,86.46 118.59,91.43 94.06,91.43 U9.NO | F11.P$2 136.12,16.65 133.49,19.28 133.49,19.57 129.69,23.37 109.25,23.37 95.52,37.1 U8.NO
  Bottom 3.556: U8.NO 93.98,38.1 90.17,41.91 90.17,62.23 92.71,64.77 U7.NO
AUX1  (via drill 0.25)
  Top 0.381: v34.29,74.3 34.29,88.58 37.78,92.08 38.42,92.08 38.73,91.76 40.01,91.76 40.96,92.71 41.91,92.71 J6.48 | v58.42,60.33 63.82,60.33 64.45,59.69 U7.RC
  Bottom 0.381: U8.RC 64.55,33.3 64.55,33.88 63.39,35.05 63.39,58.42 64.55,59.59 U7.RC | v34.29,74.3 48.26,60.33 v58.42,60.33
AUX2
  Top 0.381: J6.45 39.37,93.03 40.32,93.03 41.59,94.3 43.18,94.3 45.72,96.84 53.98,96.84 57.47,93.34 58.74,93.34 59.69,94.3 59.69,94.93 60.64,95.89 61.91,95.89 63.18,94.61 63.18,87.63 64.45,86.36 U9.RC
AUX3  (via drill 0.25)
  Top 0.381: v126.36,94.93 127.32,93.98 128.59,93.98 129.54,93.03 U11.PWM
  Bottom 0.381: v126.36,94.93 100.01,94.93 98.42,96.52 98.42,98.11 46.99,98.11 43.81,94.93 43.81,90.17 37.78,90.17 37.15,90.81 37.15,92.39 36.83,92.71 J6.42
AUX5
  Bottom 0.381: J10.3 40.89,10.81 40.6,11.1 40.6,20.16 R15.2 40.01,20.32 40.01,23.18 46.35,23.18 51.75,28.57 51.75,34.29 22.86,63.18 22.86,83.82 31.75,92.71 J6.36
AUX6  (via drill 0.25)
  Top 0.381: v33.34,74.3 33.34,88.58 29.21,92.71 J6.33
  Bottom 0.381: v33.34,74.3 33.34,73.98 52.39,54.93 52.39,28.26 51.12,26.99 51.12,20.32 43.5,20.32 42.86,19.68 42.86,11.11 J10.2
CUR_MEAS  (via drill 0.25)
  Top 0.381: U6.1 54.33,35.64 54.33,35.05 50.53,31.25 v48.49,31.25 47.32,30.09 47.32,28.33 48.49,27.16 50.53,27.16 58.42,35.05 R6.1 58.42,35.93 60.76,35.93 C6.1 | v32.42,52.58 32.42,54.33 J3.P3
  Bottom 0.381: v32.42,52.58 32.42,47.32 v48.49,31.25
FMAIN1_5V
  Top 0.61: F1.2 2.54,17.78 1.27,16.51 1.27,14.22 J7.2
FMAIN2_5V
  Top 0.61: F2.2 6.22,18.92 3.81,16.51 3.81,14.22 J7.5
FMAIN3_5V
  Top 0.61: F3.2 10.16,17.78 8.89,16.51 8.89,14.22 J7.8
FMAIN4_5V
  Top 0.61: F4.2 13.84,18.92 11.43,16.51 11.43,14.22 J7.11
FMAIN5_5V
  Top 0.61: 17.65,20.19 13.97,16.51 13.97,14.22 J7.14
  Top 0.762: F5.2 17.65,20.19
FMAIN6_5V
  Top 0.61: 21.46,20.19 19.05,17.78 17.78,17.78 16.51,16.51 16.51,14.22 J7.17
  Top 0.762: F6.2 21.46,20.19
FMAIN7_5V
  Top 0.61: 25.27,20.19 22.86,17.78 20.32,17.78 19.05,16.51 19.05,14.22 J7.20
  Top 0.762: F7.2 25.27,20.19
FMAIN8_5V
  Top 0.61: 24.13,17.78 21.59,15.24 21.59,14.22 J7.23
  Top 0.711: 26.67,17.78 24.13,17.78
  Top 0.762: F8.2 29.08,20.19 26.67,17.78
FRFD_5V
  Top 0.381: F30.1 100.48,91.72 100.48,94.64 101.65,95.81 101.65,96.69 102.53,97.56 103.99,97.56 105.16,98.73 J8.5
GND  (via drill 0.25)
  Top 0.381: v102.82,7.59 102.82,9.35 J17.2 | 108.08,42.94 108.08,44.4 R12.2 108.37,44.69 108.37,46.74 C8.2 | 108.08,42.94 108.08,42.06 U5.2 | 108.08,42.94 109.25,42.94 117.42,34.76 119.18,34.76 R14.1 119.47,34.47 121.81,34.47 133.2,23.08 | 133.2,23.08 135.83,25.7 U2.P6 | J22.3 131.44,9.64 131.44,11.39 133.49,13.44 133.49,22.49 133.2,22.78 R2.2 133.2,23.08 | C7.2 13.14,49.37 13.14,47.03 R10.2 12.85,46.74 12.85,44.4 U4.2 12.85,44.11 12.85,43.81 13.73,42.94 35.05,42.94 36.8,41.19 36.8,40.6 R8.1 | C5.2 39.14,40.31 37.1,40.31 R8.1 | 34.47,34.47 39.43,29.5 U1.P6 39.14,29.5 36.51,26.87 R4.2 36.22,26.58 36.22,19.86 31.84,15.48 31.84,9.64 J12.2 | 34.47,34.47 35.64,35.64 35.64,39.43 35.93,39.73 36.22,39.73 36.8,40.31 R8.1 | 34.47,34.47 R13.1 | 66.02,27.75 64.85,27.75 U8.GND | 66.02,27.75 67.77,27.75 78.28,17.23 78.28,9.64 J19.3 78.28,9.35 78.28,8.76 v77.11,7.59 | 55.5,36.8 57.25,36.8 58.42,37.97 | 55.5,36.8 54.62,36.8 U6.2 | 58.42,37.97 60.76,37.97 C6.2 61.05,37.97 62.22,36.8 62.22,36.22 64.26,34.18 65.14,34.18 66.02,33.3 66.02,27.75 | 58.42,37.97 R6.2 | 55.5,36.8 55.5,35.34 49.66,29.5 U1.P5 | R17.1 100.48,82.96 106.03,82.96 106.91,83.83 SW2.P4 107.2,84.12 107.2,88.51 SW2.P1 | R18.1 146.34,81.2 142.25,81.2 U11.LPSU_GND | U11.GND 124.44,92.6 124.44,80.03 U11.GND1 | J3.PGND2 26.58,56.96 26.58,56.38 28.33,54.62 J3.P6 28.63,54.33 29.79,54.33 J3.P5 30.09,54.33 30.09,52.58 30.96,51.7 34.18,51.7 37.1,54.62 37.1,56.96 J3.PGND1 37.39,57.25 47.03,57.25 J4.GND2 | J4.GND2 47.03,56.96 49.37,54.62 J4.P5 49.66,54.33 49.66,53.45 50.24,52.87 51.41,52.87 51.99,53.45 51.99,54.33 J4.P3 52.29,54.62 52.29,55.21 54.04,56.96 56.67,56.96 J4.GND1 56.96,56.96 59.3,54.62 64.55,54.62 U7.GND
  Top 0.381: J4.GND2 47.32,57.25 48.78,58.71 48.78,65.72 J5.P6 48.78,66.02 46.44,68.35 J5.PGND2 46.44,68.64 46.44,71.56 44.4,73.61 44.4,85.58 | v63.68,74.78 57.54,68.64 J5.PGND1 | 44.4,85.58 51.7,85.58 56.38,90.26 57.84,90.26 SW1.P1 | 44.4,85.58 43.23,85.58 R16.1 | J8.1 100.19,98.73 61.63,98.73 58.13,95.22 SW1.P4
  Top 0.762: 31.48,8.62 J12.2
  Bottom 0.381: 102.82,9.05 v102.82,7.59 99.02,3.8 80.62,3.8 77.11,7.3 | 102.82,9.05 101.36,10.52 J18.2 | 77.11,7.3 75.36,9.05 75.36,10.52 J20.3 | 102.82,9.05 104.28,9.05 104.57,9.35 104.57,9.64 105.45,10.52 126.19,10.52 J21.3 126.48,10.52 126.48,9.93 127.36,9.05 131.15,9.05 131.44,9.35 131.44,9.93 134.95,13.44 138.16,13.44 139.62,14.9 | 139.62,14.9 138.46,16.07 138.46,23.08 | 139.62,14.9 143.71,10.81 148.68,10.81 J11.2 | 138.46,23.08 136.12,25.41 U2.P6 | 138.46,23.08 140.79,25.41 146.05,25.41 U2.P5 | 38.56,25.4 38.56,20.45 R15.1 38.56,20.16 38.85,19.86 38.85,10.81 J10.4 | J14.2 29.21,10.81 25.41,10.81 24.13,11.43 | 39.43,25.4 39.43,29.21 U1.P6 | J9.5 138.16,98.73 137.58,98.73 136.41,97.56 132.91,97.56 129.4,94.06 129.11,94.06 128.23,93.18 128.23,92.01 127.65,91.43 125.89,91.43 124.73,92.6 U11.GND | U11.LPSU_GND 141.96,81.2 135.83,81.2 134.66,80.03 U11.GND2 134.37,80.03 133.2,81.2 126.48,81.2 125.31,80.03 124.73,80.03 U11.GND1 124.44,80.03 113.33,80.03 109.54,83.83 107.2,83.83 SW2.P4 106.91,83.83 105.16,83.83 104.28,82.96 95.22,82.96 94.93,83.25 65.72,83.25 64.55,82.08 | v63.68,74.78 63.68,80.33 64.55,81.2 U9.GND 64.55,81.5 64.55,82.08 | 64.55,82.08 58.13,88.51 58.13,90.26 SW1.P1 58.13,90.55 58.13,94.93 SW1.P4 | U8.GND 64.85,28.04 64.85,28.92 67.18,31.25 67.18,51.99 64.85,54.33 U7.GND | v77.11,7.59 77.11,7.3
  Bottom 3.048: U1.P5 45.69,25.4 39.43,25.4 38.56,25.4 34.29,25.4 24.13,15.24 24.13,11.43 23.11,10.41 J7.22 J7.19 J7.16 J7.13 J7.10 J7.7 J7.4 J7.1
  pour Top: 0,0 0,100.33 160.02,100.33 160.02,0
  pour Bottom: 0,0 0,100.33 160.02,100.33 160.02,0
MAIN1  (via drill 0.25)
  Top 0.381: v3.17,69.85 26.04,92.71 26.67,92.71 J6.30
  Bottom 0.381: v3.17,69.85 3.17,16.19 2.54,15.56 J7.3
MAIN2  (via drill 0.25)
  Top 0.381: v4.13,72.39 24.13,92.39 J6.27
  Bottom 0.381: v4.13,72.39 4.13,16.51 5.08,15.56 J7.6
MAIN3  (via drill 0.25)
  Top 0.381: v8.26,79.38 21.59,92.71 J6.24
  Bottom 0.381: v8.26,79.38 8.57,79.06 8.57,28.89 8.26,28.57 8.26,16.19 7.62,15.56 J7.9
MAIN4  (via drill 0.25)
  Top 0.381: v10.16,83.82 19.05,92.71 J6.21
  Bottom 0.381: v10.16,83.82 J7.12
MAIN5  (via drill 0.25)
  Top 0.381: v11.11,87.31 16.51,92.71 J6.18
  Bottom 0.381: v11.11,87.31 11.11,17.14 12.7,15.56 J7.15
MAIN6  (via drill 0.25)
  Top 0.381: J7.18 15.24,16.51 v17.46,18.73
  Bottom 0.381: v17.46,18.73 25.4,26.67 25.4,41.27 15.24,51.44 15.24,91.44 13.97,92.71 J6.15
MAIN7
  Bottom 0.381: J7.21 17.78,15.56 11.75,21.59 11.75,85.72 12.06,86.04 12.06,92.08 11.43,92.71 J6.12
MAIN8
  Bottom 0.381: J7.24 20.32,15.24 19.05,15.24 19.05,14.92 18.41,14.29 8.89,14.29 8.89,28.26 9.21,28.57 9.21,86.36 9.53,86.68 9.53,92.08 8.89,92.71 J6.9
N$1
  Top 0.762: F12.1 33.02,17.78 29.21,13.97 29.21,9.8 J12.1
N$2
  Bottom 0.381: F15.1 44.69,18.69 44.69,10.81 J10.1
N$3
  Top 0.381: F29.1 127.36,97.56 134.66,97.56 135.83,98.73 J9.3
N$4
  Top 0.381: 142.84,88.8 146.05,88.8 JP1.2 | 142.84,88.8 142.25,88.21 U11.LH4 142.84,88.8 | F16.P$1 136.41,16.65 136.41,23.95 148.09,35.64 148.09,74.49 144,78.58 131.74,78.58 130.86,79.45 130.86,89.09 134.37,92.6 U11.LH1 134.66,92.89 137,92.89 U11.LH2 137.29,92.6 141.08,92.6 141.96,91.72 U11.LH3 142.25,91.43 142.84,90.84 142.84,88.8
N$5  (via drill 0.25)
  Top 0.381: v38.1,91.12 F10.1
  Bottom 0.381: 38.1,95.5 v38.1,91.12
  Bottom 2.54: J6.2 J6.5 J6.8 J6.11 J6.14 J6.17 J6.20 J6.23 J6.26 J6.29 J6.32 J6.35 J6.38 J6.41 38.1,95.5 J6.44 J6.47
N$6
  Top 0.381: J8.4 103.11,96.39 105.16,96.39 J8.6
N$7
  Top 0.381: R1.2 125.6,23.08 128.23,25.7 U2.P7 128.52,25.41 130.86,23.08 R2.1
N$8
  Top 0.381: R3.2 28.92,26.87 31.55,29.5 U1.P7 31.84,29.5 34.47,26.87 R4.1
N$9
  Top 0.381: C3.2 42.94,75.07 41.77,75.07 39.43,77.41 U1.P3
N$10
  Bottom 0.381: J11.1 150.72,10.81 150.72,11.39 145.76,16.36 143.13,16.36 F11.P$1
N$11
  Top 0.381: C4.2 139.33,71.27 138.46,71.27 136.12,73.61 U2.P3
N$12
  Top 0.381: U4.3 11.98,44.11 11.98,43.23 12.85,42.35 12.85,40.6 14.31,39.14 R9.V2
N$13
  Top 0.381: U4.4 11.68,41.77 11.68,39.73 11.1,39.14 R9.V1
N$14
  Top 0.381: J15.1 148.68,9.64 148.68,10.81 143.13,16.36 F16.P$2
N$15
  Top 0.381: J3.P2 33.88,54.33 34.76,54.33 J3.P1 35.05,54.62 35.05,75.07 40.6,80.62 40.6,84.71 F28.1
N$16
  Top 0.381: 140.5,79.45 137.58,79.45 137.29,79.74 U11.LGND2 | 140.5,79.45 144,79.45 148.68,74.78 148.68,16.36 150.72,14.31 150.72,9.64 J15.2 | 140.5,79.45 140.5,81.79 141.96,83.25 141.96,84.42 U11.LGND
N$17
  Top 0.381: U5.3 107.2,41.77 107.2,40.6 108.08,39.73 108.08,37.97 109.54,36.51 R11.V2
N$18
  Top 0.381: LED2.C 119.47,39.43 119.47,36.51 R14.2
N$19
  Top 0.381: LED1.C 34.47,39.43 34.47,36.51 R13.2
N$20  (via drill 0.25)
  Top 0.381: v32.72,11.1 35.34,13.73 F14.1
  Bottom 0.381: v32.72,11.1 31.84,11.1 31.55,10.81 J14.1
N$21
  Top 0.381: R1.1 123.27,23.08 120.93,25.41 U2.P8 120.64,25.41 112.17,25.41 U2.P9 | U5.5 108.95,39.43 109.83,39.43 111,38.27 111,31.84 110.49,30.13 110.12,31.84 109.83,32.13 R11.I2
  Top 3.556: U2.P9 110.49,30.13
N$22
  Top 0.381: U5.4 106.91,39.43 106.91,37.1 106.32,36.51 R11.V1
N$23
  Top 0.381: R3.1 26.87,26.87 24.24,29.5 U1.P8 | U4.5 13.73,41.77 14.9,41.77 15.77,40.89 15.77,35.93 15.24,34.29 14.61,34.76 R9.I2
  Top 3.556: U1.P9 15.24,30.51 15.24,34.29
  Bottom 0.381: U1.P8 23.95,29.21 14.02,29.21 U1.P9
N$24
  Top 0.381: U6.3 54.33,37.68 53.45,37.68 52.58,36.8 51.7,36.8 49.37,34.47 49.37,33.88 R5.V2
N$25
  Top 0.381: 44.45,32.42 50.83,32.42 51.99,33.59 51.99,35.64 U6.5 | R7.2 39.43,33.59 42.94,33.59 44.45,33.02 44.98,33.88 R5.I2
  Top 3.556: 44.45,33.02 44.45,32.42 44.45,22.86 51.01,16.3 J1.2 J1.1
N$26
  Top 0.381: J19.1 74.49,9.35 75.36,8.47 75.36,8.18 76.82,6.72 80.33,6.72 81.79,8.18 81.79,8.76 85.58,12.56 85.58,16.36 F20.P$1
N$27
  Top 0.381: J19.2 76.24,9.64 76.24,14.31 74.19,16.36 F21.P$2
N$28
  Bottom 0.381: J20.1 79.45,10.81 79.45,15.19 80.62,16.36 F22.P$1
N$29
  Bottom 0.381: J20.2 77.41,10.52 77.41,9.93 78.28,9.05 80.03,9.05 80.33,9.35 80.33,11.1 85.58,16.36 F23.P$2
N$30
  Top 0.381: J17.1 100.78,9.64 100.78,12.85 97.27,16.36 F18.P$2
N$31
  Bottom 0.381: J18.1 103.69,10.81 103.69,16.36 F19.P$2
N$32
  Top 0.381: J22.2 129.69,9.64 129.69,14.61 131.44,16.36 F27.P$1
N$33
  Top 0.381: J22.1 127.36,9.64 123.56,13.44 123.27,13.44 120.34,16.36 F26.P$1
N$34
  Bottom 0.381: J21.2 128.23,10.81 128.23,11.39 126.19,13.44 123.27,13.44 120.34,16.36 F25.P$1
N$35
  Bottom 0.381: J21.1 130.28,15.19 131.44,16.36 F24.P$1
N$36
  Top 0.381: U6.4 51.99,37.68 49.66,37.68 49.37,37.39 R5.V1
N$37
  Top 0.381: 148.39,81.5 R18.2 | 154.81,85 H1.B3,2
  Top 0.762: 148.39,81.5 151.31,81.5 154.81,85
N$38
  Top 0.381: SW2.GND4 119.76,85 119.76,87.92 SW2.GND3 | R17.2 100.48,85 103.69,85 SW2.GND2 103.99,85 103.99,87.92 SW2.GND1
  Bottom 0.381: SW2.GND4 119.47,85 117.72,85 117.13,85.58 104.57,85.58 103.99,85 SW2.GND2
N$39
  Top 0.381: 61.34,92.6 61.34,94.06 SW1.GND2 | 61.34,92.6 61.34,91.14 SW1.GND1 | R16.2 43.23,87.34 43.23,88.8 45.28,90.84 SW1.GND3 45.57,91.14 45.57,92.6 | 45.57,92.6 45.57,94.06 SW1.GND4 | 45.57,92.6 61.34,92.6
RC_SIG
  Bottom 0.381: J6.3 3.81,93.03 1.91,94.93 1.91,97.79 3.49,99.38 99.06,99.38 99.06,98.42 100.01,97.47 131.76,97.47 133.35,99.06 J9.1
RCTS
  Top 0.381: J5.P4 51.7,66.02 51.7,66.6 80.03,94.93 97.27,94.93 99.9,97.56 101.65,97.56 102.82,98.73 J8.3
RRTS
  Top 0.381: J5.P5 50.24,65.72 50.24,65.14 54.33,61.05 92.6,61.05 93.47,61.92 95.22,61.92 110.12,76.82 110.12,94.06 111.87,95.81 111.87,97.85 112.75,98.73 J8.11
RRX
  Top 0.381: J5.P2 54.04,66.02 54.04,67.77 80.03,93.76 95.81,93.76 99.31,90.26 101.36,90.26 106.62,95.52 106.62,97.56 107.78,98.73 J8.7
RTX
  Top 0.381: J8.9 109.25,97.56 109.25,76.82 94.93,62.51 92.89,62.51 92.01,63.39 54.33,63.39 52.87,64.85 52.87,65.72 J5.P3
SYNC  (via drill 0.25)
  Top 0.381: v79.45,7.89 80.33,8.76 80.33,9.35 J19.4 | v102.53,12.56 104.86,10.22 104.86,9.64 J17.3
  Bottom 0.381: 79.45,8.47 80.33,8.47 80.62,8.76 81.79,8.76 83.54,10.52 99.31,10.52 J18.3 99.61,11.39 100.78,12.56 v102.53,12.56 | 79.45,8.47 77.11,8.47 76.24,9.35 76.24,12.27 75.95,12.56 74.49,12.56 73.32,11.39 73.32,10.81 J20.4 | 79.45,8.47 v79.45,7.89
V+
  Top 0.381: 13.97,75.07 17.53,75.07 C1.1 | 110.49,71.27 113.92,71.27 C2.1
  Top 3.048: 44.84,42.79 48.53,46.48 96.77,46.48 110.49,60.2 110.49,71.27 U2.P1
  Top 3.556: R5.I1 44.84,42.79 40.64,46.99 25.4,46.99 13.97,58.42 13.97,75.07 U1.P1
V-  (via drill 0.25)
  Top 0.381: C2.2 117.13,70.98 137,70.98 138.75,69.23 140.5,69.23 142.25,70.98 C4.1 142.54,71.27 143.71,71.27 146.05,73.61 U2.P4 | v26.87,75.07 20.74,75.07 C1.2 | C3.1 45.86,75.07 47.03,75.07 49.37,77.41 U1.P4
  Top 3.81: J1.4 J1.3
  Bottom 0.381: v26.87,75.07 46.74,75.07 48.49,76.82 U1.P4
  Bottom 2.54: U2.P4 139.73,67.31 102.87,67.31 96.77,73.39 92.96,73.39 88.9,69.85 69.85,69.85 67.31,67.18 60.96,67.18 | U1.P4 52.1,77.44 57.15,72.39 58.42,72.39 60.96,69.85
  Bottom 3.81: J1.3 60.96,24.03 60.96,67.18 60.96,69.85
V_MEAS  (via drill 0.25)
  Top 0.381: R8.2 37.1,38.56 39.14,38.56 C5.1 39.43,38.27 v39.43,37.1 39.43,35.34 R7.1 | v31.25,52.58 31.25,54.33 J3.P4
  Bottom 0.381: v31.25,52.58 31.25,45.28 v39.43,37.1
VCC_POS  (via drill 0.25)
  Top 0.381: v89.09,20.84 92.01,16.65 F20.P$2
  Top 0.762: U7.COM 94.06,54.33 88.79,54.33 v84.51,50.05
  Bottom 0.381: v89.09,20.84 84.51,20.84 80.14,20.84 75.95,16.65 74.19,16.65 F22.P$2
  Bottom 0.762: 84.51,20.84 v84.51,50.05
VCC_STROBE
  Top 0.381: 94.06,27.75 92.01,27.75 80.91,16.65 F21.P$1 | 94.06,27.75 103.4,18.4 103.4,16.65 F18.P$1 | 94.06,27.75 U8.COM
  Bottom 0.381: 92.89,16.65 96.98,16.65 F19.P$1 | 92.89,16.65 92.3,16.65 F23.P$1 92.89,16.65 | 92.89,16.65 92.89,26.58 94.06,27.75 U8.COM
VCC_TAXI  (via drill 0.25)
  Top 0.381: F26.P$2 113.63,16.65 115.38,16.65 v116.84,18.11 118.3,19.57 121.81,19.57 124.73,16.65 F24.P$2
  Top 0.762: U9.COM 94.05,78.05 92.73,76.87 v92.72,69.41
  Bottom 0.381: F24.P$2 124.73,16.65 121.81,19.57 118.3,19.57 v116.84,18.11 115.38,16.65 113.63,16.65 F26.P$2 113.33,16.65 113.33,17.82
  Bottom 0.762: v92.72,69.41 91.62,68.06 86.65,63.09 86.65,40.89 92.43,35.2 96.03,35.2 100.08,31.16 100.08,24.64 102.11,22.61 107.44,22.61 F26.P$2

### Text on the board
tPlace: Mugin Power Distribution / v2 Jul-16-2015
tNames: X4r | RFD900 | Chassis | TELEM1 | PWR | ADC | Raspi 5V | VCC / GND | Batt | Wing | Red / Yellow / Black / Blue | Collision | Yellow / Black / Blue | Landing | Red / Yellow / Black | Payload | VCC / GND
bNames: VID 5V | VCC / GND | Lidar-Lite | Wifi / 24VDC